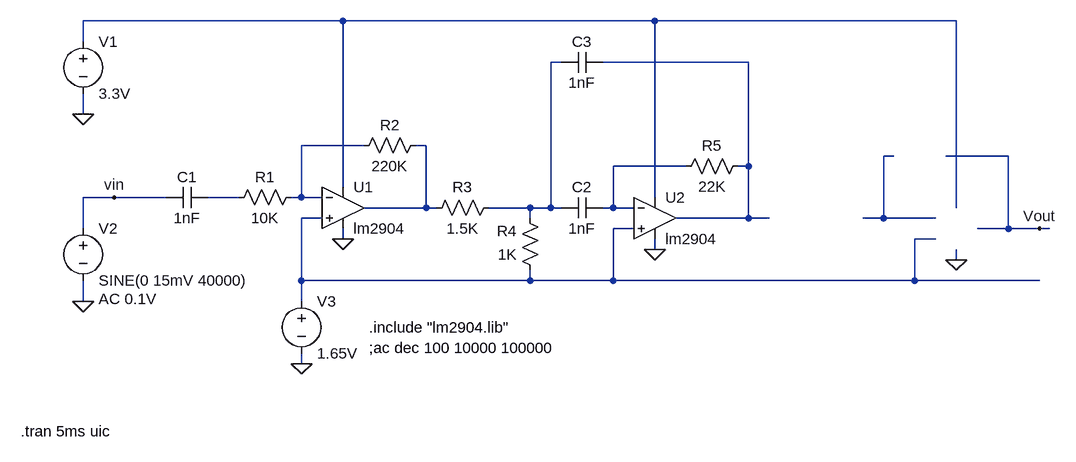
[diagram p0: schematic receiver-4 .asc]
receiver-4 .asc, the LTspice schematic file:
Version 4
SHEET 1 1544 680
WIRE 96 -128 -304 -128
WIRE 576 -128 96 -128
WIRE 1040 -128 576 -128
WIRE -304 -96 -304 -128
WIRE 432 -64 416 -64
WIRE 720 -64 496 -64
WIRE -304 16 -304 -16
WIRE 128 64 32 64
WIRE 224 64 208 64
WIRE 944 80 928 80
WIRE 1120 80 1024 80
WIRE 624 96 512 96
WIRE 720 96 720 -64
WIRE 720 96 704 96
WIRE 96 128 96 -128
WIRE -256 144 -304 144
WIRE -176 144 -256 144
WIRE -64 144 -112 144
WIRE 32 144 32 64
WIRE 32 144 16 144
WIRE 64 144 32 144
WIRE 576 144 576 -128
WIRE 224 160 224 64
WIRE 224 160 128 160
WIRE 240 160 224 160
WIRE 384 160 320 160
WIRE 416 160 416 -64
WIRE 416 160 384 160
WIRE 432 160 416 160
WIRE 512 160 512 96
WIRE 512 160 496 160
WIRE 544 160 512 160
WIRE 1040 160 1040 -128
WIRE 64 176 32 176
WIRE 384 176 384 160
WIRE 720 176 720 96
WIRE 720 176 608 176
WIRE 752 176 720 176
WIRE 928 176 928 80
WIRE 928 176 896 176
WIRE 1008 176 928 176
WIRE -304 192 -304 144
WIRE 544 192 512 192
WIRE 1120 192 1120 80
WIRE 1120 192 1072 192
WIRE 1168 192 1120 192
WIRE 1184 192 1168 192
WIRE 96 208 96 192
WIRE 1008 208 976 208
WIRE 576 224 576 208
WIRE 1040 240 1040 224
WIRE 32 272 32 176
WIRE 384 272 384 256
WIRE 384 272 32 272
WIRE 512 272 512 192
WIRE 512 272 384 272
WIRE 976 272 976 208
WIRE 976 272 512 272
WIRE 1168 272 976 272
WIRE -304 304 -304 272
WIRE 32 304 32 272
WIRE 32 400 32 384
FLAG 96 208 0
FLAG 576 224 0
FLAG -304 16 0
FLAG -304 304 0
FLAG 32 400 0
FLAG 1168 192 Vout
FLAG -256 144 vin
FLAG 1040 240 0
SYMBOL Opamps\\opamp2 96 96 R0
SYMATTR InstName U1
SYMATTR Value lm2904
SYMBOL cap -112 128 R90
WINDOW 0 0 32 VBottom 2
WINDOW 3 32 32 VTop 2
SYMATTR InstName C1
SYMATTR Value 1nF
SYMBOL res 32 128 R90
WINDOW 0 0 56 VBottom 2
WINDOW 3 32 56 VTop 2
SYMATTR InstName R1
SYMATTR Value 10K
SYMBOL res 224 48 R90
WINDOW 0 0 56 VBottom 2
WINDOW 3 32 56 VTop 2
SYMATTR InstName R2
SYMATTR Value 220K
SYMBOL res 336 144 R90
WINDOW 0 0 56 VBottom 2
WINDOW 3 32 56 VTop 2
SYMATTR InstName R3
SYMATTR Value 1.5K
SYMBOL res 400 272 R180
WINDOW 0 36 76 Left 2
WINDOW 3 36 40 Left 2
SYMATTR InstName R4
SYMATTR Value 1K
SYMBOL cap 496 144 R90
WINDOW 0 0 32 VBottom 2
WINDOW 3 32 32 VTop 2
SYMATTR InstName C2
SYMATTR Value 1nF
SYMBOL cap 496 -80 R90
WINDOW 0 0 32 VBottom 2
WINDOW 3 32 32 VTop 2
SYMATTR InstName C3
SYMATTR Value 1nF
SYMBOL res 720 80 R90
WINDOW 0 0 56 VBottom 2
WINDOW 3 32 56 VTop 2
SYMATTR InstName R5
SYMATTR Value 22K
SYMBOL Opamps\\opamp2 576 112 R0
SYMATTR InstName U2
SYMATTR Value lm2904
SYMBOL voltage -304 -112 R0
WINDOW 123 0 0 Left 2
WINDOW 39 0 0 Left 2
SYMATTR InstName V1
SYMATTR Value 3.3V
SYMBOL voltage -304 176 R0
WINDOW 123 24 124 Left 2
WINDOW 39 0 0 Left 2
SYMATTR Value2 AC 0.1V
SYMATTR InstName V2
SYMATTR Value SINE(0 15mV 40000)
SYMBOL voltage 32 288 R0
WINDOW 123 0 0 Left 2
WINDOW 39 0 0 Left 2
SYMATTR InstName V3
SYMATTR Value 1.65V
TEXT 136 344 Left 2 !.include "lm2904.lib"
TEXT -400 504 Left 2 !.tran 5ms uic
TEXT 136 376 Left 2 !;ac dec 100 10000 100000

The netlist it stands for:
* receiver-4 .asc
XU1 N009 N004 N001 0 N005 lm2904  ; pins In+ In- V+ V- OUT
C1 N008 vin 1nF
R1 N004 N008 10K
R2 N005 N004 220K
R3 N002 N005 1.5K
R4 N009 N002 1K
C2 N007 N002 1nF
C3 N003 N002 1nF
R5 N003 N007 22K
XU2 N009 N007 N001 0 N003 lm2904  ; pins In+ In- V+ V- OUT
V1 N001 0 3.3V
V2 vin 0 SINE(0 15mV 40000) AC 0.1V
V3 N009 0 1.65V
.include "lm2904.lib"
.tran 5ms uic
;ac dec 100 10000 100000
.backanno
.end